# Altium project MP4462_MP4560_AllCanUse.PrjPCB
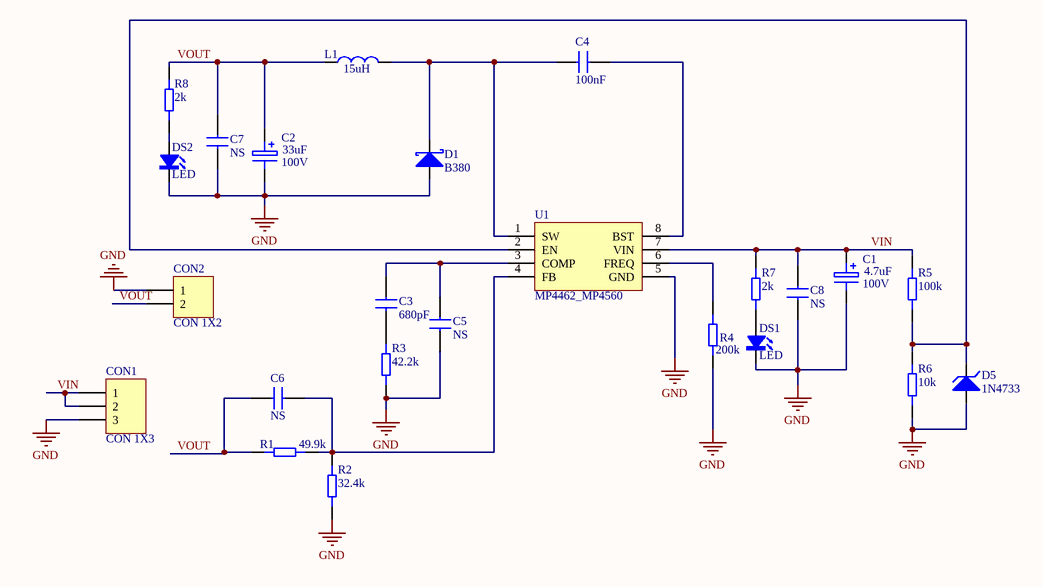
[diagram p0: MP4462_MP4560_AllCanUse.SchDoc]
1 sheet, 24 parts. Net scope: global (net labels, ports and power ports of the same name join across sheets).
Board file: MP4462_MP4560_AllCanUse.PcbDoc

## Sheet MP4462_MP4560_AllCanUse.SchDoc
size A3; Organization: Altium Limited; Address1: L3, 12a Rodborough Rd; Address2: Frenchs Forest; Address3: NSW; Address4: Australia 2086

### Parts
C1  value 4.7uF  Rated Voltage: 100V  [C-E-5X10X12mm]  (hidden comment: CAP-E)
C2  value 33uF  Rated Voltage: 100V  [C-E-5X10X12mm]  (hidden comment: CAP-E)
C3  value 680pF  [C0805]  (hidden comment: Cap)
C4  value 100nF  [C0805]  (hidden comment: Cap)
C5  value NS  [C0805]  (hidden comment: Cap)
C6  value NS  [C0805]  (hidden comment: Cap)
C7  value NS  [C0805]  (hidden comment: Cap)
C8  value NS  [C0805]  (hidden comment: Cap)
CON1  CON 1X3  [KF128-5.08mm-3P]
CON2  CON 1X2  [KF128-5.08mm-2P]
D1  B380  [LC-SMB(DO-214AA)_S1]
D5  1N4733  [SOD-123]
DS1  LED  [LED-0805]
DS2  LED  [LED-0805]
L1  L-SMD  [SLF12575T]  (value not drawn)
R1  value 49.9k  [R0805]  (hidden comment: RES)
R2  value 32.4k  [R0805]  (hidden comment: RES)
R3  value 42.2k  [R0805]  (hidden comment: RES)
R4  value 200k  [R0805]  (hidden comment: RES)
R5  value 100k  [R0805]  (hidden comment: RES)
R6  value 10k  [R0805]  (hidden comment: RES)
R7  value 2k  [R0805]  (hidden comment: RES)
R8  value 2k  [R0805]  (hidden comment: RES)
U1  MP4462_MP4560  [LC-SOIC-8_EP_150mil]

### Nets
GND: C1.2 C2.2 C5.2 C7.2 C8.2 CON1.3 CON2.1 D1.1 D5.1 DS1.K DS2.K R2.1 R3.1 R4.1 R6.1 U1.5(GND)
VIN: C1.1 C8.1 CON1.1 CON1.2 R5.2 R7.2 U1.7(VIN)
VOUT: C2.1 C6.1 C7.1 CON2.2 L1.1 R1.2 R8.2
NetC3_1: C3.1 C5.1 U1.3(COMP)
NetC3_2: C3.2 R3.2
NetC4_1: C4.1 D1.2 L1.2 U1.1(SW)
NetC4_2: C4.2 U1.8(BST)
NetC6_2: C6.2 R1.1 R2.2 U1.4(FB)
NetD5_2: D5.2 R5.1 R6.2 U1.2(EN)
NetDS1_A: DS1.A R7.1
NetDS2_A: DS2.A R8.1
NetR4_2: R4.2 U1.6(FREQ)

### Notes on the sheet
- Title
- Size:
- Date:
- A3
- Number:
- Time:
- Revision:
- Sheet
- of
- File:
- (in symbol L-SMD) 15uH

### Library data of the parts
C1 C2 = CAP-E: 电解电容; Manufacturer: Rubycon红宝石; Tolerance: 20%
C3-C8 = CAP-SMD: SMD-CAP（陶瓷电容）; Manufacturer: muRata村田; Tolerance: 20%; Rated Voltage: 50V
D1 = D-Schottky: Diode Schottky
D5 = D-Manostat: Diode Manostat
L1 = L-SMD: Inductor
R1-R8 = RES: Resistor; Manufacturer: SAMSUNG三星; Tolerance: 5%